# Altium project SmartSocket V1.0.PrjPcb (part 3 of 3)
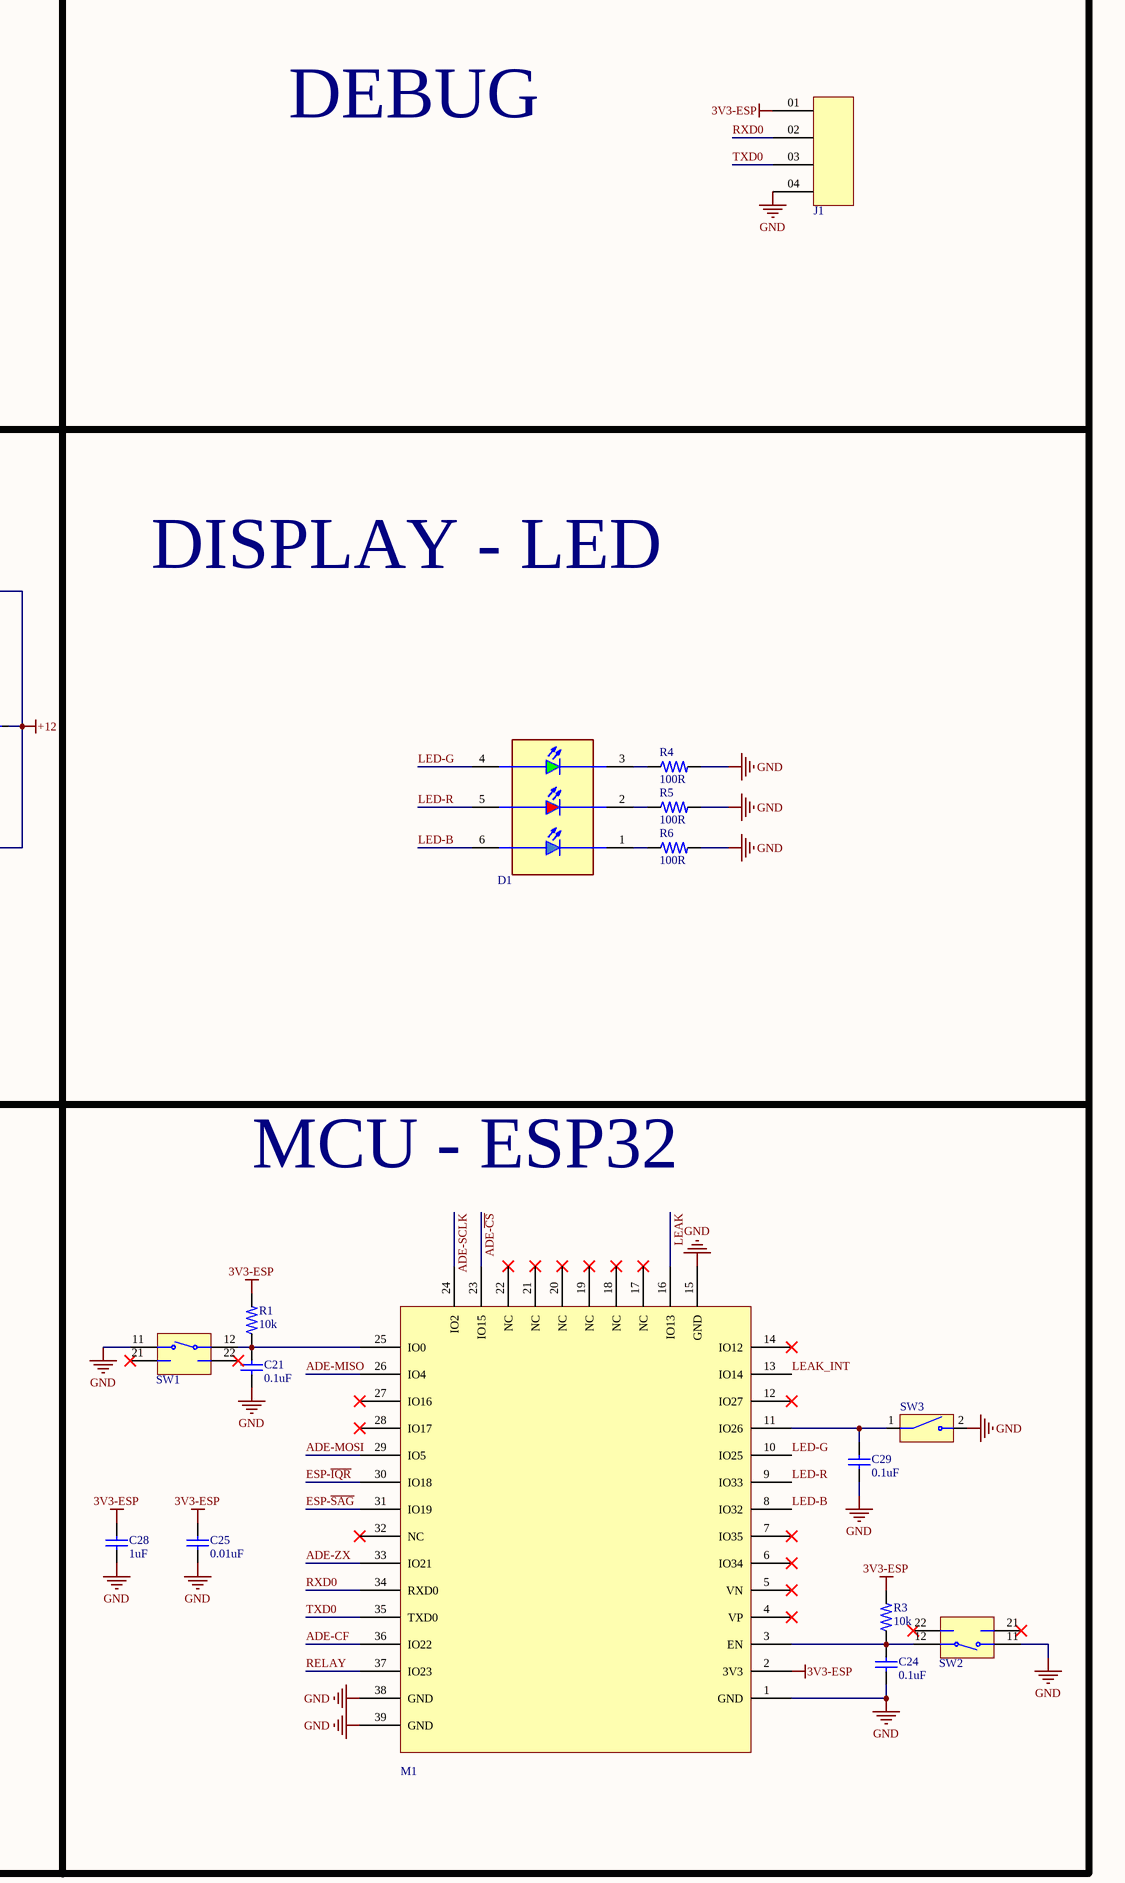
[diagram p4: SmartSocket V1.0.SchDoc, right]

## Sheet SmartSocket V1.0.SchDoc (continued)

### Library data of the parts (continued)
Q2 Q3 = TRAN; NPN; 500mA;V;  BC817-25LT1G: Single Bipolar Transistor, NPN, 45 V, 500 mA, 225 mW, SOT-23 (TO-236), 3 Pins, Surface Mount; Manufacturer: ON Semiconductor; Max Power Dissipation: 300mW; hFE Min: 160; Max Collector Current: 500mA; Collector Emitter Breakdown Voltage: 45V; Collector Base Voltage (VCBO): 50V; Collector-emitter Voltage-Max: 700mV; Number of Elements: 1; Emitter Base Voltage (VEBO): 5V; Designer: TVBac; Supplier: Future Electronics; Supplier Part Number: 8062284; Manufacturer Part Number: BC817-25LT1G; RoHS: Yes; Category: BJTs; Stock: 1185000; Pricing: 3000=0.0157, 12000=0.0151, 30000=0.0146, 75000=0.0142, 120000=0.0136 (USD); Case/Package: SOT-23-3; Pins: 3; Contact Plating: Tin,Matte; Min Operating Temperature: -55°C; Max Operating Temperature: 150°C; Package Quantity: 3000; Packaging: Tape and Reel; Transition Frequency: 100MHz; Polarity: NPN; Max Breakdown Voltage: 45V; Power Dissipation: 300mW; Clock Frequency: 100MHz; Series: -; Frequency: 100MHz; Collector Emitter Voltage (VCEO): 45V; Collector Emitter Saturation Voltage: 700mV; Gain Bandwidth Product: 100MHz; Current Rating: 500mA; Length: 2.9mm; Width: 1.3mm; Height: 0.94mm; Radiation Hardening: No; Lead Free: Lead Free; RoHS Compliant: Yes; Reach SVHC Compliant: No; ComponentLink1URL: https://datasheet.ciiva.com/27748/2010413-27748829.pdf?src-supplier=Jameco; ComponentLink1Description: https://datasheet.ciiva.com/27748/2010413-27748829.pdf?src-supplier=Jameco; ComponentLink2URL: https://datasheet.ciiva.com/1196/bc817-16lt1-d-1196558.pdf?src-supplier=Element14; ComponentLink2Description: https://datasheet.ciiva.com/1196/bc817-16lt1-d-1196558.pdf?src-supplier=Element14; ComponentLink3URL: https://datasheet.ciiva.com/22641/bc817-16lt1-d-22641013.pdf?src-supplier=Farnell; ComponentLink3Description: https://datasheet.ciiva.com/22641/bc817-16lt1-d-22641013.pdf?src-supplier=Farnell; ComponentLink4URL: https://datasheet.ciiva.com/22664/bc817-16lt1-d-22664204.pdf?src-supplier=Element14; ComponentLink4Description: https://datasheet.ciiva.com/22664/bc817-16lt1-d-22664204.pdf?src-supplier=Element14; ComponentLink5URL: https://datasheet.ciiva.com/22664/1842041-22664101.pdf?src-supplier=Element14; ComponentLink5Description: https://datasheet.ciiva.com/22664/1842041-22664101.pdf?src-supplier=Element14; ComponentLink6Description: Link Digikey; ComponentLink6URL: https://www.digikey.com/en/products/detail/onsemi/BC817-25LT1G/918339
R1 R3 R8 R20 R23-R25 R28 R29 R39 = RES; 10K; 0603; SMD; ESR03EZPF1002: SMD Chip Resistor, 10 kOhm, ± 1%, 250 mW, 0603 [1608 Metric], Thick Film, Anti-Surge; Manufacturer: Rohm; Power Rating: 250mW; Temperature Coefficient: 100ppm/°C; Voltage Rating (DC): 150V; Designer: TVBac; Supplier: Digikey; Supplier Part Number: RHM10KADCT-ND; Manufacturer Part Number: ESR03EZPF1002; RoHS: Yes; Category: Chip SMD Resistors; Stock: 2136779; Pricing: 1=0.16, 10=0.078, 50=0.0516, 100=0.044, 500=0.03138, 1000=0.02764 (USD); Case/Package: 0603; Case Code (Metric): 1608; Case Code (Imperial): 0603; Min Operating Temperature: -55°C; Max Operating Temperature: 155°C; Tolerance: 1%; Package Quantity: 1; Packaging: Cut Tape; Number of Terminations: 2; Max Power Dissipation: 250mW; Features: Automotive AEC-Q200; Series: ESR; Length: 0.063inch; Width: 0.031inch; Height: 0.022inch; Ratings: AEC-Q200; RoHS Compliant: Yes; Lead Free: 5697LeadFree; ComponentLink1URL: https://datasheet.ciiva.com/2469/esr-2469710.pdf?src-supplier=Digikey; ComponentLink1Description: https://datasheet.ciiva.com/2469/esr-2469710.pdf?src-supplier=Digikey; ComponentLink2URL: https://datasheet.ciiva.com/2469/esr-2469711.pdf?src-supplier=Digikey; ComponentLink2Description: https://datasheet.ciiva.com/2469/esr-2469711.pdf?src-supplier=Digikey; ComponentLink3URL: https://datasheet.ciiva.com/2469/esr-2469709.pdf?src-supplier=Digikey; ComponentLink3Description: https://datasheet.ciiva.com/2469/esr-2469709.pdf?src-supplier=Digikey; ComponentLink4Description: Link Digikey; ComponentLink4URL: https://www.digikey.com/en/products/detail/rohm-semiconductor/ESR03EZPF1002/1983429
R4-R6 R9 R11 R19 R21 R22 R27 R31 R32 = RES; 100R; 0603; SMD; KTR03EZPF1000: Res Thick Film 0603 100 Ohm 1% 0.1W(1/10W) ±100ppm/C Pad SMD T/R Automotive AEC-Q200; Manufacturer: Rohm; Max Power Dissipation: 100mW; Temperature Coefficient: 100ppm/°C; Voltage Rating: 350V; Designer: TVBac; Supplier: Mouser; Supplier Part Number: 755-KTR03EZPF1000; Manufacturer Part Number: KTR03EZPF1000; RoHS: Yes; Category: Chip SMD Resistors; Stock: 66325; Pricing: 1=0.12, 10=0.039, 50=0.039, 100=0.024, 1000=0.021, 10000=0.015 (USD); Case/Package: 0603; Case Code (Metric): 1608; Case Code (Imperial): 0603; Min Operating Temperature: -55°C; Max Operating Temperature: 155°C; Packaging: Cut Tape; Tolerance: 1%; Number of Terminations: 2; Features: Automotive AEC-Q200; Series: KTR; Voltage Rating (DC): 350V; Ratings: AEC-Q200; RoHS Compliant: Yes; ComponentLink1URL: https://datasheet.ciiva.com/14926/ktr-14926472.pdf?src-supplier=Digikey; ComponentLink1Description: https://datasheet.ciiva.com/14926/ktr-14926472.pdf?src-supplier=Digikey; ComponentLink2URL: https://datasheet.ciiva.com/14932/ktr-14932133.pdf?src-supplier=Digikey; ComponentLink2Description: https://datasheet.ciiva.com/14932/ktr-14932133.pdf?src-supplier=Digikey; ComponentLink3Description: Link Digikey; ComponentLink3URL: https://www.digikey.com/en/products/detail/rohm-semiconductor/KTR03EZPF1000/4051558
R7 R57 = RES; SHUNT; 10mOhm; SMD; WFMA2512R0100FEA: Res Current Sense Metal Plate 2512 0.01 Ohm 1% 3W ±110ppm/°C Molded T/R; Manufacturer: Vishay; Designer: TVBac; Supplier: Digikey; Supplier Part Number: 541-10292-6-ND; Manufacturer Part Number: WFMA2512R0100FEA; RoHS: Yes; Category: Chip SMD Resistors; Pricing: 1=2.85, 10=1.682, 25=1.3844, 50=1.2026, 100=1.0506, 250=0.88712, 500=0.78654, 1000=0.70625 (USD); Power Rating: 3W; Temperature Coefficient: 110ppm/°C; ComponentLink1URL: http://www.vishay.com/docs/30387/wfm.pdf?src-supplier=Digikey; ComponentLink1Description: http://www.vishay.com/docs/30387/wfm.pdf?src-supplier=Digikey; ComponentLink2URL: http://www.farnell.com/datasheets/2793367.pdf?src-supplier=Newark; ComponentLink2Description: http://www.farnell.com/datasheets/2793367.pdf?src-supplier=Newark; ComponentLink3Description: Link Digikey; ComponentLink3URL: https://www.digikey.com/en/products/detail/vishay-dale/WFMA2512R0100FEA/9992531; ComponentLink4Description: Link CXT; ComponentLink4URL: https://linhkien.cxt.vn/3121-wfma2512r0100fea-tro-001-ohms-1-3w.html
R10 R12 R13 R17 R35 R37 R38 R40 R42 R43 R46 R47 R49 R54-R56 R58 = RES; 1K; 0603; SMD; ESR03EZPF1001: SMD Chip Resistor, 1 kOhm, ± 1%, 250 mW, 0603 [1608 Metric], Thick Film, Anti-Surge; Manufacturer: Rohm; Voltage Rating: 150V; Designer: TVBac; Supplier: Digikey; Supplier Part Number: RHM1.00KADCT-ND; Manufacturer Part Number: ESR03EZPF1001; RoHS: Yes; Category: Chip SMD Resistors; Stock: 2703233; Pricing: 1=0.11, 10=0.055, 50=0.0364, 100=0.0309, 500=0.02206, 1000=0.01943 (USD); Voltage Rating (DC): 150V; Lead Free: 5697LeadFree; ComponentLink1URL: https://datasheet.ciiva.com/2469/esr-2469712.pdf?src-supplier=Digikey; ComponentLink1Description: https://datasheet.ciiva.com/2469/esr-2469712.pdf?src-supplier=Digikey; ComponentLink2URL: https://datasheet.ciiva.com/2469/esr-2469713.pdf?src-supplier=Digikey; ComponentLink2Description: https://datasheet.ciiva.com/2469/esr-2469713.pdf?src-supplier=Digikey; ComponentLink3URL: https://datasheet.ciiva.com/2469/esr-2469714.pdf?src-supplier=Digikey; ComponentLink3Description: https://datasheet.ciiva.com/2469/esr-2469714.pdf?src-supplier=Digikey; ComponentLink4Description: Link Digikey; ComponentLink4URL: https://www.digikey.com/en/products/detail/rohm-semiconductor/ESR03EZPF1001/1983428
R14-R16 R18 = RES; 300K; 0603; SMD; KTR03EZPF3003: Res High Voltage Thick Film 0603 300k Ohm 1% 1/10W ±100ppm/°C Molded Paper T/R; Manufacturer: Rohm; Max Power Dissipation: 100mW; Voltage Rating: 350V; Designer: TVBac; Supplier: Mouser; Supplier Part Number: 755-KTR03EZPF3003; Manufacturer Part Number: KTR03EZPF3003; RoHS: Yes; Category: Chip SMD Resistors; Stock: 9502; Pricing: 1=0.17, 10=0.055, 50=0.055, 100=0.032, 1000=0.026, 10000=0.019 (USD); Case/Package: 0603; Case Code (Metric): 1608; Case Code (Imperial): 0603; Min Operating Temperature: -55°C; Max Operating Temperature: 155°C; Package Quantity: 5000; Packaging: Cut Tape; Tolerance: 1%; Number of Terminations: 2; Temperature Coefficient: 100ppm/°C; Features: Automotive AEC-Q200; Series: KTR; Voltage Rating (DC): 350V; Length: 0.063inch; Width: 0.031inch; Height: 0.022inch; RoHS Compliant: Yes; ComponentLink1URL: https://datasheet.ciiva.com/14926/ktr-14926439.pdf?src-supplier=Digikey; ComponentLink1Description: https://datasheet.ciiva.com/14926/ktr-14926439.pdf?src-supplier=Digikey; ComponentLink2URL: https://datasheet.ciiva.com/14925/ktr-14925709.pdf?src-supplier=Digikey; ComponentLink2Description: https://datasheet.ciiva.com/14925/ktr-14925709.pdf?src-supplier=Digikey; ComponentLink3Description: Link Digikey; ComponentLink3URL: https://www.digikey.com/en/products/detail/rohm-semiconductor/KTR03EZPF3003/4051625
R26 R33 R34 = RES; 4.7K; 0603; SMD; SFR03EZPF4701: Res Anti-Sulfured Thick Film 0603 4.7k Ohm 1% 1/10W ±100ppm/°C Molded Paper T/R; Manufacturer: Rohm; Power Rating: 100mW; Voltage Rating (DC): 50V; Designer: TVBac; Supplier: Mouser; Supplier Part Number: 755-SFR03EZPF4701; Manufacturer Part Number: SFR03EZPF4701; RoHS: Yes; Category: Chip SMD Resistors; Stock: 30180; Pricing: 1=0.14, 10=0.045, 50=0.045, 100=0.027, 1000=0.02, 10000=0.014 (USD); ComponentLink1URL: http://www.farnell.com/datasheets/2611943.pdf?src-supplier=Farnell; ComponentLink1Description: http://www.farnell.com/datasheets/2611943.pdf?src-supplier=Farnell; ComponentLink2URL: http://www.farnell.com/datasheets/2611943.pdf?src-supplier=Newark; ComponentLink2Description: http://www.farnell.com/datasheets/2611943.pdf?src-supplier=Newark; ComponentLink3URL: http://www.farnell.com/datasheets/2611943.pdf?src-supplier=Element14; ComponentLink3Description: http://www.farnell.com/datasheets/2611943.pdf?src-supplier=Element14; ComponentLink4URL: https://www.rohm.com/datasheet/SFR03EZPF/sfr-e?src-supplier=Digikey; ComponentLink4Description: https://www.rohm.com/datasheet/SFR03EZPF/sfr-e?src-supplier=Digikey; ComponentLink5Description: Link Digikey; ComponentLink5URL: https://www.digikey.com/en/products/detail/rohm-semiconductor/SFR03EZPF4701/9771855
R30 = RES; 300K; 1206; ESR18EZPF3003: Res Thick Film 1206 300K Ohm 1% 0.5W(1/2W) ±100ppm/C Epoxy Resin Pad SMD Automotive T/R; Manufacturer: Rohm; Max Power Dissipation: 500mW; Temperature Coefficient: 100ppm/°C; Voltage Rating: 200V; Designer: TVBac; Supplier: Mouser; Supplier Part Number: 755-ESR18EZPF3003; Manufacturer Part Number: ESR18EZPF3003; RoHS: Yes; Category: Chip SMD Resistors; Stock: 34367; Pricing: 1=0.12, 10=0.042, 50=0.042, 100=0.026, 1000=0.023, 10000=0.016 (USD); Case/Package: 1206; Case Code (Metric): 3216; Case Code (Imperial): 1206; Min Operating Temperature: -55°C; Max Operating Temperature: 155°C; Tolerance: 1%; Packaging: Cut Tape; Number of Terminations: 2; Features: Automotive AEC-Q200; Series: ESR; Ratings: AEC-Q200; RoHS Compliant: Yes; ComponentLink1URL: https://datasheet.ciiva.com/2527/esr-2527195.pdf?src-supplier=Digikey; ComponentLink1Description: https://datasheet.ciiva.com/2527/esr-2527195.pdf?src-supplier=Digikey; ComponentLink2URL: https://datasheet.ciiva.com/2527/esr-2527196.pdf?src-supplier=Digikey; ComponentLink2Description: https://datasheet.ciiva.com/2527/esr-2527196.pdf?src-supplier=Digikey; ComponentLink3URL: https://datasheet.ciiva.com/2527/esr-2527197.pdf?src-supplier=Digikey; ComponentLink3Description: https://datasheet.ciiva.com/2527/esr-2527197.pdf?src-supplier=Digikey; ComponentLink4Description: Link Digikey; ComponentLink4URL: https://www.digikey.com/en/products/detail/rohm-semiconductor/ESR18EZPF3003/1983605
R36 R41 R44 R45 R48 = RES; 100K; 0603; SMD; ESR03EZPJ104: Res Thick Film 0603 100K Ohm 5% 0.25W(1/4W) ±200ppm/C Pad SMD Automotive T/R; Manufacturer: Rohm; Voltage Rating: 150V; Designer: TVBac; Supplier: Digikey; Supplier Part Number: RHM100KDCT-ND; Manufacturer Part Number: ESR03EZPJ104; RoHS: Yes; Category: Chip SMD Resistors; Stock: 165361; Pricing: 1=0.1, 10=0.048, 50=0.0312, 100=0.0265, 500=0.0188, 1000=0.0165 (USD); Voltage Rating (DC): 150V; Lead Free: 5697LeadFree; ComponentLink1URL: https://datasheet.ciiva.com/14924/esr-14924811.pdf?src-supplier=Digikey; ComponentLink1Description: https://datasheet.ciiva.com/14924/esr-14924811.pdf?src-supplier=Digikey; ComponentLink2URL: https://datasheet.ciiva.com/14928/esr-14928813.pdf?src-supplier=Digikey; ComponentLink2Description: https://datasheet.ciiva.com/14928/esr-14928813.pdf?src-supplier=Digikey; ComponentLink3URL: https://datasheet.ciiva.com/14930/esr-14930633.pdf?src-supplier=Digikey; ComponentLink3Description: https://datasheet.ciiva.com/14930/esr-14930633.pdf?src-supplier=Digikey; ComponentLink4Description: Link Digikey; ComponentLink4URL: https://www.digikey.com/en/products/detail/rohm-semiconductor/ESR03EZPJ104/4051180
SW1 SW2 = BUT; SW; SMD; EVQ-P7L01P: Tactile Switch SPST-NO Side Actuated Surface Mount, Right Angle; MF: Panasonic Electronic Components; SnapEDA_Link: https://www.snapeda.com/parts/EVQ-P7L01P/Panasonic+Electronic+Components/view-part/?ref=snap; Package: None; MP: EVQ-P7L01P; Check_prices: https://www.snapeda.com/parts/EVQ-P7L01P/Panasonic+Electronic+Components/view-part/?ref=eda; Purchase-URL: https://pricing.snapeda.com/search/part/EVQ-P7L01P/?ref=eda; Digi-Key_Part_Number: P16769TR-ND; Value: *
SW3 = BUT; SW; SMD; PTS636SM50JSMTRLFS: Switch Tactile N.O. SPST Rectangular Button J-Bend 0.05A 12VDC 1.77N SMD T/R; Manufacturer: ITT C&K; Contact Resistance: 100mR; Number of Positions: 2NUMBER; Supplier: Digikey; Supplier Part Number: CKN12319-1-ND; Manufacturer Part Number: PTS636SM50JSMTRLFS; RoHS: No; Category: Tactile Switches; Stock: 80725; Pricing: 1=0.21, 10=0.199, 25=0.1888, 100=0.1717, 250=0.1614, 500=0.14766 (USD); ComponentLink1Description: Link Digikey; ComponentLink1URL: https://www.digikey.com/en/products/detail/c-k/PTS636-SM50J-SMTR-LFS/10071732
T1 = EE13/6/6-Power: OFFLINE TRANSFORMER 6W EE13/7/6; MF: Wurth Electronics Inc; SnapEDA_Link: https://www.snapeda.com/parts/EE13/6/6/Wurth+Electronics/view-part/?ref=snap; Package: Package; Value: *; MP: EE13/6/6; Check_prices: https://www.snapeda.com/parts/EE13/6/6/Wurth+Electronics/view-part/?ref=eda
VR1 = VAR; 470V; 100A; B72220S0301K101: Epcos St&ard Series Metal Oxide Varistor 580pF 100A; Clamping 775V; Varistor 470V; Manufacturer: TDK EPCOS; Designer: TVBac; Supplier: Digikey; Supplier Part Number: 495-2406-ND; Manufacturer Part Number: B72220S0301K101; RoHS: Yes; Category: Varistors; Stock: 16323; Pricing: 1=0.84, 10=0.737, 25=0.6924, 100=0.5652, 250=0.52496, 500=0.44676, 1000=0.35741, 2500=0.3239, 5000=0.31025 (USD); ComponentLink1URL: https://datasheet.ciiva.com/11834/0900766b80188ddb-11834361.pdf?src-supplier=Rs; ComponentLink1Description: https://datasheet.ciiva.com/11834/0900766b80188ddb-11834361.pdf?src-supplier=Rs; ComponentLink2URL: https://datasheet.ciiva.com/4540/siov-leaded-standard-4540645.pdf?src-supplier=Mouser; ComponentLink2Description: https://datasheet.ciiva.com/4540/siov-leaded-standard-4540645.pdf?src-supplier=Mouser; ComponentLink3URL: https://datasheet.ciiva.com/1278/1899727-1278204.pdf?src-supplier=Element14; ComponentLink3Description: https://datasheet.ciiva.com/1278/1899727-1278204.pdf?src-supplier=Element14; ComponentLink4Description: Link Digikey; ComponentLink4URL: https://www.digikey.com/en/products/detail/epcos-tdk-electronics/B72220S0301K101/651287
X1 = OSC; 3.58M; 3.579545M; ABLS-3.579545MHZ-B2-T: Crystal 3.579545MHz ±20ppm (Tol) ±50ppm (Stability) 18pF FUND 180Ohm 2-Pin HC-49/US SMD T/R; Manufacturer: Abracon; Designer: TVBac; Supplier: Digikey; Supplier Part Number: 535-9081-1-ND; Manufacturer Part Number: ABLS-3.579545MHZ-B2-T; RoHS: Yes; Category: Crystals; Stock: 16401; Pricing: 1=0.27, 10=0.231, 50=0.208, 100=0.1989, 500=0.17934, 1000=0.17152, 2000=0.16407, 3000=0.15987, 5000=0.15474, 7000=0.15146, 10000=0.14806, 25000=0.13969, 50000=0.13369 (USD); ComponentLink1URL: https://datasheet.ciiva.com/15116/getdatasheetpartid-719903-15116782.pdf?src-supplier=Verical; ComponentLink1Description: https://datasheet.ciiva.com/15116/getdatasheetpartid-719903-15116782.pdf?src-supplier=Verical; ComponentLink2URL: https://datasheet.ciiva.com/16410/abls-16410837.pdf?src-supplier=Future+Electronics; ComponentLink2Description: https://datasheet.ciiva.com/16410/abls-16410837.pdf?src-supplier=Future+Electronics; ComponentLink3URL: https://datasheet.ciiva.com/854/abls-854273.pdf?src-supplier=Digikey; ComponentLink3Description: https://datasheet.ciiva.com/854/abls-854273.pdf?src-supplier=Digikey; ComponentLink4URL: https://datasheet.ciiva.com/854/abls-854274.pdf?src-supplier=Digikey; ComponentLink4Description: https://datasheet.ciiva.com/854/abls-854274.pdf?src-supplier=Digikey; ComponentLink5URL: https://datasheet.ciiva.com/854/abls-854275.pdf?src-supplier=Digikey; ComponentLink5Description: https://datasheet.ciiva.com/854/abls-854275.pdf?src-supplier=Digikey; ComponentLink6URL: https://datasheet.ciiva.com/4945/abls-44621-4945006.pdf?src-supplier=Mouser; ComponentLink6Description: https://datasheet.ciiva.com/4945/abls-44621-4945006.pdf?src-supplier=Mouser; ComponentLink7URL: https://datasheet.ciiva.com/7998/abls-7998431.pdf?src-supplier=Element14; ComponentLink7Description: https://datasheet.ciiva.com/7998/abls-7998431.pdf?src-supplier=Element14; ComponentLink8Description: Link Digikey; ComponentLink8URL: https://www.digikey.com/en/products/detail/abracon-llc/ABLS-3-579545MHZ-B2-T/675276